# Altium schematic sheet TopSchematic.SchDoc: Top Schematic
size A4; DrawnBy: IPE; Engineer: IPE; Address1: ETML-ES; Address2: Rue de Sébeillon 12; Address3: 1004 Lausanne; Revision: v 0.1; SheetNumber: 1; SheetTotal: 3
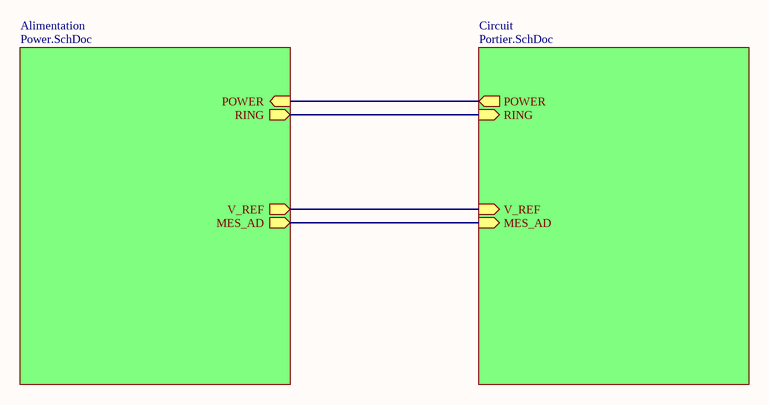
[diagram p0: TopSchematic.SchDoc]

## Sub-sheets
Alimentation = Power.SchDoc: RING (out), POWER (in), V_REF (out), MES_AD (out)
Circuit = Portier.SchDoc: MES_AD (in), V_REF (in), RING (in), POWER (out)

## Nets
(unnamed): sheet Alimentation/RING, sheet Circuit/RING
(unnamed): sheet Alimentation/POWER, sheet Circuit/POWER
(unnamed): sheet Alimentation/V_REF, sheet Circuit/V_REF
(unnamed): sheet Alimentation/MES_AD, sheet Circuit/MES_AD

## Notes on the sheet
- Title
- Size:
- Date:
- A4
- Number:
- Time:
- Revision:
- Sheet
- of
- File: